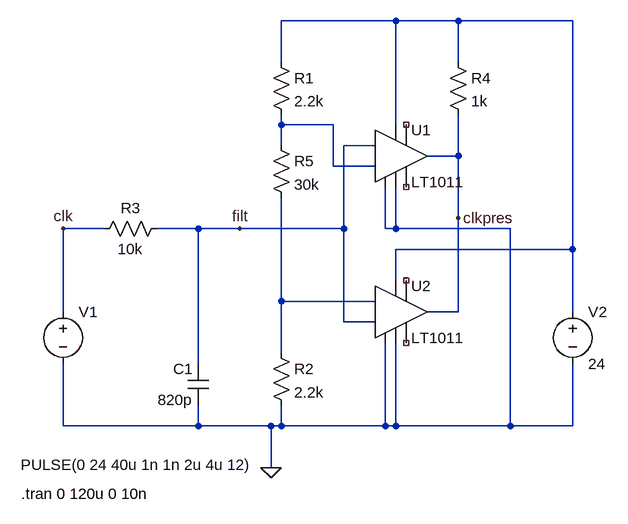
[diagram p0: schematic amp_saver.asc]
amp_saver.asc, the LTspice schematic file:
Version 4
SHEET 1 880 680
WIRE 192 -176 16 -176
WIRE 288 -176 192 -176
WIRE 464 -176 288 -176
WIRE 16 -112 16 -176
WIRE 288 -112 288 -176
WIRE 16 -16 16 -32
WIRE 96 -16 16 -16
WIRE 192 -16 192 -176
WIRE 16 16 16 -16
WIRE 160 16 112 16
WIRE 288 32 288 -32
WIRE 288 32 240 32
WIRE 96 48 96 -16
WIRE 160 48 96 48
WIRE 288 128 288 32
WIRE -256 144 -320 144
WIRE -112 144 -176 144
WIRE -48 144 -112 144
WIRE 112 144 112 16
WIRE 112 144 -48 144
WIRE 176 144 176 80
WIRE 192 144 192 80
WIRE 192 144 176 144
WIRE 368 144 192 144
WIRE 464 176 464 -176
WIRE 464 176 192 176
WIRE 192 224 192 176
WIRE 16 256 16 96
WIRE 160 256 16 256
WIRE -320 272 -320 144
WIRE 288 272 288 128
WIRE 288 272 240 272
WIRE 464 272 464 176
WIRE 112 288 112 144
WIRE 160 288 112 288
WIRE 16 336 16 256
WIRE -112 352 -112 144
WIRE -320 448 -320 352
WIRE -112 448 -112 416
WIRE -112 448 -320 448
WIRE 0 448 -112 448
WIRE 16 448 16 416
WIRE 16 448 0 448
WIRE 176 448 176 320
WIRE 176 448 16 448
WIRE 192 448 192 320
WIRE 192 448 176 448
WIRE 368 448 368 144
WIRE 368 448 192 448
WIRE 464 448 464 352
WIRE 464 448 368 448
WIRE 0 512 0 448
FLAG 0 512 0
FLAG 288 128 clkpres
FLAG -320 144 clk
FLAG -48 144 filt
SYMBOL res 0 -128 R0
SYMATTR InstName R1
SYMATTR Value 2.2k
SYMBOL res 0 320 R0
SYMATTR InstName R2
SYMATTR Value 2.2k
SYMBOL res -160 128 R90
WINDOW 0 0 56 VBottom 2
WINDOW 3 32 56 VTop 2
SYMATTR InstName R3
SYMATTR Value 10k
SYMBOL res 272 -128 R0
SYMATTR InstName R4
SYMATTR Value 1k
SYMBOL cap -96 416 R180
WINDOW 0 24 56 Left 2
WINDOW 3 24 8 Left 2
SYMATTR InstName C1
SYMATTR Value 820p
SYMBOL voltage -320 256 R0
WINDOW 3 -65 252 Left 2
WINDOW 123 0 0 Left 2
WINDOW 39 0 0 Left 2
SYMATTR Value PULSE(0 24 40u 1n 1n 2u 4u 12)
SYMATTR InstName V1
SYMBOL voltage 464 256 R0
WINDOW 123 0 0 Left 2
WINDOW 39 0 0 Left 2
SYMATTR InstName V2
SYMATTR Value 24
SYMBOL res 0 0 R0
SYMATTR InstName R5
SYMATTR Value 30k
SYMBOL Comparators\\LT1011 192 32 R0
SYMATTR InstName U1
SYMBOL Comparators\\LT1011 192 272 R0
SYMATTR InstName U2
TEXT -384 552 Left 2 !.tran 0 120u 0 10n

The netlist it stands for:
* amp_saver.asc
R1 N001 N002 2.2k
R2 N003 0 2.2k
R3 filt clk 10k
R4 N001 clkpres 1k
C1 0 filt 820p
V1 clk 0 PULSE(0 24 40u 1n 1n 2u 4u 12)
V2 N001 0 24
R5 N002 N003 30k
XU1 0 N002 filt 0 NC_01 NC_02 clkpres N001 LT1011
XU2 0 filt N003 0 NC_03 NC_04 clkpres N001 LT1011
.tran 0 120u 0 10n
.lib LTC1.lib
.backanno
.end